# Altium schematic sheet USB_To_Serial.SchDoc
size A4; SheetNumber: 6; SheetTotal: 12
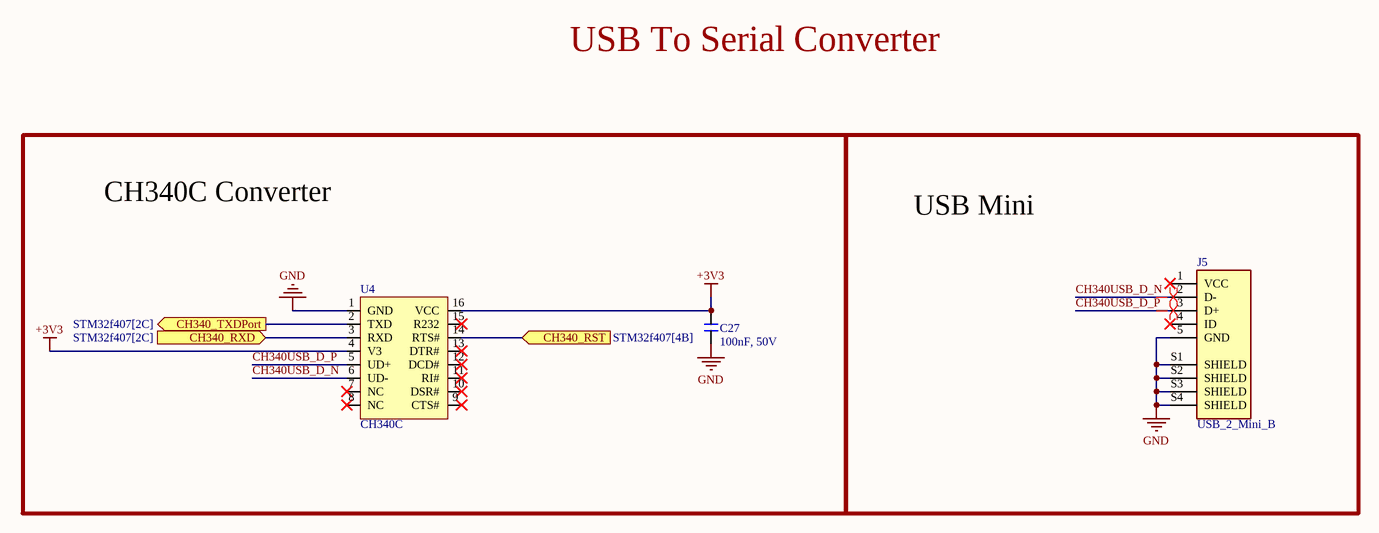
[diagram p0: USB_To_Serial.SchDoc]

## Parts
C27  100nF, 50V  [Capacitor_0805]
J5  USB_2_Mini_B  [USB_2_Mini]
U4  CH340C  [SOIC-16]

## Blocks framed on the sheet
CH340C Converter: C27 U4
USB Mini: J5

## Ports
CH340_RST (in, see STM32f407[4B]), CH340_RXD (in, see STM32f407[2C]), CH340_TXDPort (out, see STM32f407[2C])

## Nets
+3V3: C27.2 U4.4(V3) U4.16(VCC)
GND: C27.1 J5.5(GND) J5.S1(SHIELD) J5.S2(SHIELD) J5.S3(SHIELD) J5.S4(SHIELD) U4.1(GND)
CH340_RST: U4.14(RTS#) ; port CH340_RST
CH340_RXD: U4.3(RXD) ; port CH340_RXD
CH340_TXDPort: U4.2(TXD) ; port CH340_TXDPort
CH340USB_D_N: J5.2(D-) U4.6(UD-)
CH340USB_D_P: J5.3(D+) U4.5(UD+)

Not connected (* = marked no-connect by the designer): J5 1(VCC)* 4(ID)*; U4 7(NC)* 8(NC)* 9(CTS#)* 10(DSR#)* 11(RI#)* 12(DCD#)* 13(DTR#)* 15(R232)*

## Layout directives
differential pair; net class Diff_90Ohm: CH340USB_D_N, CH340USB_D_P

## Notes on the sheet
- USB To Serial Converter

## Library data of the parts
C27 = Cap_100nF_0805: Multilayer Ceramic Capacitor, 0.1 uF, 50 V, ï¿½ 10%, X7R, 0805 [2012 Metric]; Manufacturer: Samsung; Manufacturer Part Number: CL21B104KBCNNNC; Supplier: Digikey; Supplier Part Number: 1276-1003-1-ND; RoHS: Yes; Category: Ceramic Capacitors; Stock: 674609; Pricing: 1=0,08, 10=0,012, 100=0,0104, 1000=0,008 (USD); Mounting Technology: Surface Mount; Case/Package: 0805; Case Code (Metric): 2012; Case Code (Imperial): 0805; Material: Ceramic; Min Operating Temperature: -55°C; Max Operating Temperature: 125°C; Tolerance: 10%; Value: 100nF; Dielectric: X7R; Packaging: Tape and Reel; Voltage Rating: 50V; Voltage: 50V; Series: CL; Construction: Flat; Voltage Rating (DC): 50V; Length: 2mm; Width: 0.049inch; Height: 0.85mm; Depth: 1.25mm; Thickness: 0.037inch; Radiation Hardening: No; RoHS Compliant: Yes; Lead Free: 5697LeadFree; ComponentLink1URL: https://datasheet.ciiva.com/25710/cl21b104kbcnnnc-25710182.pdf?src-supplier=Digikey; ComponentLink1Description: https://datasheet.ciiva.com/25710/cl21b104kbcnnnc-25710182.pdf?src-supplier=Digikey; ComponentLink2URL: https://datasheet.ciiva.com/29199/454152-da-01-en-vs-kondensator-0805-29199814.pdf?src-supplier=Conrad; ComponentLink2Description: https://datasheet.ciiva.com/29199/454152-da-01-en-vs-kondensator-0805-29199814.pdf?src-supplier=Conrad
J5 = USB2_Mini_690-B_005-299-043: Conn Mini USB 2.0 Type B RCP 5 POS 0.8mm Solder RA SMD 5 Terminal 1 Port; Manufacturer: EDAC; Manufacturer Part Number: 690-005-299-043; Number of Contacts: 5; Gender: Receptacle; Number of Ports: 1; Mating Cycles: 1500; Shielding: Unshielded; USB Standard: 6108USBStandard; Current Rating: 1A; Supplier: Digikey; Supplier Part Number: 151-1206-1-ND; RoHS: No; Category: USB Connectors; Stock: 51741; Pricing: 1=0,56, 10=0,475, 25=0,4452, 50=0,4238, 100=0,4036, 250=0,37828, 500=0,3602 (USD); Mounting Technology: Surface Mount,Horizontal; Color: Black; Contact Material: Bronze; Contact Plating: Gold; Housing Material: Thermoplastic; Insulation Color: Black; Min Operating Temperature: -30°C; Max Operating Temperature: 80°C; Packaging: Cut Tape; Series: 690; Connector Type: USB; Termination: Solder; Orientation: Right Angle; Height: 3.98mm; Pitch: 0.8mm; Lead Free: Lead Free; Flammability Rating: UL94 V-0; ComponentLink1URL: https://datasheet.ciiva.com/30246/690-005-299-043-30246515.pdf?src-supplier=Onlinecomponents.com; ComponentLink1Description: https://datasheet.ciiva.com/30246/690-005-299-043-30246515.pdf?src-supplier=Onlinecomponents.com; ComponentLink2URL: https://datasheet.ciiva.com/29660/690-005-299-043-29660027.pdf?src-supplier=Digikey; ComponentLink2Description: https://datasheet.ciiva.com/29660/690-005-299-043-29660027.pdf?src-supplier=Digikey; ComponentLink3URL: https://datasheet.ciiva.com/29660/690-005-299-043-29660028.pdf?src-supplier=Digikey; ComponentLink3Description: https://datasheet.ciiva.com/29660/690-005-299-043-29660028.pdf?src-supplier=Digikey; ComponentLink4URL: https://datasheet.ciiva.com/29660/690-005-299-043-29660029.pdf?src-supplier=Digikey; ComponentLink4Description: https://datasheet.ciiva.com/29660/690-005-299-043-29660029.pdf?src-supplier=Digikey
U4 = IC_USB_To_SerialCH340C: 2Mbps Transceiver USB 2.0 SOP-16 USB Converters ROHS; Manufacturer: WCH(Jiangsu Qin Heng); Manufacturer Part Number: CH340C; Supplier: LCSC; Supplier Part Number: C84681